# Altium schematic sheet K60单片机系统板原理图.SchDoc
size A4
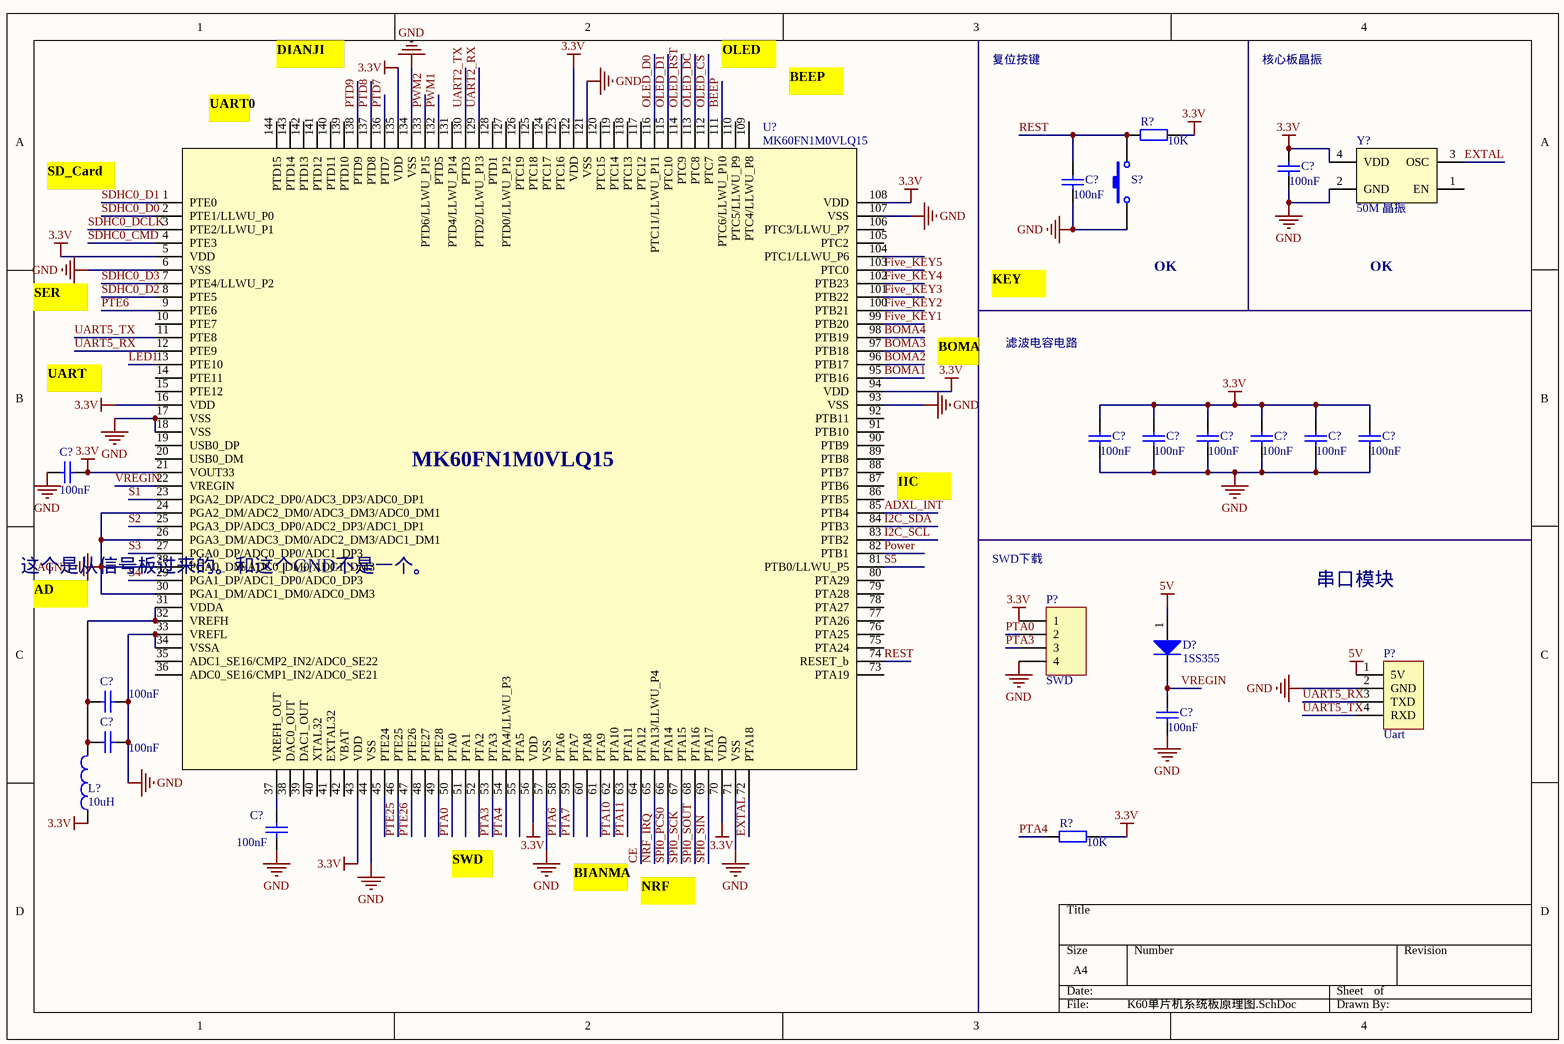
[diagram p0: K60单片机系统板原理图.SchDoc]

## Parts
(Parts that share a designator on the sheet are numbered #1, #2 ... from top to bottom, then left to right.)
C?#1  value 100nF  [C0603]  (hidden comment: Cap)
C?#2  value 100nF  [C0603]  (hidden comment: Cap)
C?#3  value 100nF  [C0603]  (hidden comment: Cap)
C?#4  value 100nF  [C0603]  (hidden comment: Cap)
C?#5  value 100nF  [C0603]  (hidden comment: Cap)
C?#6  value 100nF  [C0603]  (hidden comment: Cap)
C?#7  value 100nF  [C0603]  (hidden comment: Cap)
C?#8  value 100nF  [C0603]  (hidden comment: Cap)
C?#9  value 100nF  [C0603]  (hidden comment: Cap)
C?#10  value 100nF  [C0603]  (hidden comment: Cap)
C?#11  value 100nF  [C0603]  (hidden comment: Cap)
C?#12  value 100nF  [C0603]  (hidden comment: Cap)
C?#13  value 100nF  [C0603]  (hidden comment: Cap)
D?  1SS355  [二极管贴片]
L?  value 10uH  [R0603]  (hidden comment: Inductor)
P?#1  SWD  [HDR1X4]
P?#2  Uart  [HDR1X4]
R?#1  value 10K  [R0603]  (hidden comment: Res2)
R?#2  value 10K  [R0603]  (hidden comment: Res2)
S?  SW-PB  [KEY]  (value not drawn)
U?  MK60FN1M0VLQ15  [K60_QFP144]
Y?  50M 晶振  [50MHz_MiNi]

## Nets
3.3V: C?#1.1 C?#3.1 C?#4.1 C?#5.1 C?#6.1 C?#7.1 C?#8.1 C?#9.2 L?.1 P?#1.1 R?#1.2 R?#2.2 U?.5(VDD) U?.16(VDD) U?.21(VOUT33) U?.43(VDD) U?.56(VDD) U?.70(VDD) U?.94(VDD) U?.108(VDD) U?.122(VDD) U?.135(VDD) Y?.4(VDD)
5V: D?.1(A) P?#2.1(5V)
AGND: U?.24(PGA2_DM/ADC2_DM0/ADC3_DM3/ADC0_DM1) U?.26(PGA3_DM/ADC3_DM0/ADC2_DM3/ADC1_DM1) U?.28(PGA0_DM/ADC0_DM0/ADC1_DM3) U?.30(PGA1_DM/ADC1_DM0/ADC0_DM3)
GND: C?#1.2 C?#2.2 C?#3.2 C?#4.2 C?#5.2 C?#6.2 C?#7.2 C?#8.2 C?#9.1 C?#10.2 C?#11.1 C?#12.2 C?#13.2 P?#1.4 P?#2.2(GND) S?.1 U?.6(VSS) U?.17(VSS) U?.18(VSS) U?.33(VREFL) U?.34(VSSA) U?.44(VSS) U?.57(VSS) U?.71(VSS) U?.93(VSS) U?.107(VSS) U?.121(VSS) U?.134(VSS) Y?.2(GND)
ADXL_INT: U?.85(PTB4)
BEEP: U?.111(PTC6/LLWU_P10)
BOMA1: U?.95(PTB16)
BOMA2: U?.96(PTB17)
BOMA3: U?.97(PTB18)
BOMA4: U?.98(PTB19)
CE: U?.64(PTA12)
EXTAL: U?.72(PTA18) Y?.3(OSC)
Five_KEY1: U?.99(PTB20)
Five_KEY2: U?.100(PTB21)
Five_KEY3: U?.101(PTB22)
Five_KEY4: U?.102(PTB23)
Five_KEY5: U?.103(PTC0)
I2C_SCL: U?.83(PTB2)
I2C_SDA: U?.84(PTB3)
LED1: U?.13(PTE10)
NRF_IRQ: U?.65(PTA13/LLWU_P4)
OLED_CS: U?.112(PTC7)
OLED_D0: U?.116(PTC11/LLWU_P11)
OLED_D1: U?.115(PTC10)
OLED_DC: U?.113(PTC8)
OLED_RST: U?.114(PTC9)
Power: U?.82(PTB1)
PTA0: P?#1.2 U?.50(PTA0)
PTA3: P?#1.3 U?.53(PTA3)
PTA4: R?#2.1 U?.54(PTA4/LLWU_P3)
PTA6: U?.58(PTA6)
PTA7: U?.59(PTA7)
PTA10: U?.62(PTA10)
PTA11: U?.63(PTA11)
PTD7: U?.136(PTD7)
PTD8: U?.137(PTD8)
PTD9: U?.138(PTD9)
PTE6: U?.9(PTE6)
PTE25: U?.46(PTE25)
PTE26: U?.47(PTE26)
PWM1: U?.132(PTD5)
PWM2: U?.133(PTD6/LLWU_P15)
REST: C?#2.1 R?#1.1 S?.2 U?.74(RESET_b)
S1: U?.23(PGA2_DP/ADC2_DP0/ADC3_DP3/ADC0_DP1)
S2: U?.25(PGA3_DP/ADC3_DP0/ADC2_DP3/ADC1_DP1)
S3: U?.27(PGA0_DP/ADC0_DP0/ADC1_DP3)
S4: U?.29(PGA1_DP/ADC1_DP0/ADC0_DP3)
S5: U?.81(PTB0/LLWU_P5)
SDHC0_CMD: U?.4(PTE3)
SDHC0_D0: U?.2(PTE1/LLWU_P0)
SDHC0_D1: U?.1(PTE0)
SDHC0_D2: U?.8(PTE5)
SDHC0_D3: U?.7(PTE4/LLWU_P2)
SDHC0_DCLK: U?.3(PTE2/LLWU_P1)
SPI0_PCS0: U?.66(PTA14)
SPI0_SCK: U?.67(PTA15)
SPI0_SIN: U?.69(PTA17)
SPI0_SOUT: U?.68(PTA16)
UART2_RX: U?.129(PTD2/LLWU_P13)
UART2_TX: U?.130(PTD3)
UART5_RX: P?#2.3(TXD) U?.12(PTE9)
UART5_TX: P?#2.4(RXD) U?.11(PTE8)
VREGIN: C?#11.2 D?.2(K) U?.22(VREGIN)
NetC?#10_1: C?#10.1 C?#12.1 L?.2 U?.31(VDDA) U?.32(VREFH)
NetC?#13_1: C?#13.1 U?.37(VREFH_OUT)

Not connected (* = marked no-connect by the designer): U? 10(PTE7) 14(PTE11) 15(PTE12) 19(USB0_DP) 20(USB0_DM) 35(ADC1_SE16/CMP2_IN2/ADC0_SE22) 36(ADC0_SE16/CMP1_IN2/ADC0_SE21) 38(DAC0_OUT) 39(DAC1_OUT) 40(XTAL32) 41(EXTAL32) 42(VBAT) 45(PTE24) 48(PTE27) 49(PTE28) 51(PTA1) 52(PTA2) 55(PTA5) 60(PTA8) 61(PTA9) 73(PTA19) 75(PTA24) 76(PTA25) 77(PTA26) 78(PTA27) 79(PTA28) 80(PTA29) 86(PTB5) 87(PTB6) 88(PTB7) 89(PTB8) 90(PTB9) 91(PTB10) 92(PTB11) 104(PTC1/LLWU_P6) 105(PTC2) 106(PTC3/LLWU_P7) 109(PTC4/LLWU_P8) 110(PTC5/LLWU_P9) 117(PTC12) 118(PTC13) 119(PTC14) 120(PTC15) 123(PTC16) 124(PTC17) 125(PTC18) 126(PTC19) 127(PTD0/LLWU_P12) 128(PTD1) 131(PTD4/LLWU_P14) 139(PTD10) 140(PTD11) 141(PTD12) 142(PTD13) 143(PTD14) 144(PTD15); Y? 1(EN)

## Notes on the sheet
- (near U?) UART0
- DIANJI
- OLED
- BEEP
- 复位按键
- 核心板晶振
- SD_Card
- OK
- SER
- KEY
- UART
- BOMA
- 滤波电容电路
- (near U?) IIC
- (near U?) 这个是从信号板过来的。和这个GND不是一个。
- SWD下载
- 串口模块
- AD
- SWD
- BIANMA
- NRF

## Library data of the parts
C?#1-C?#13 = Cap: Capacitor; Published: 8-Jun-2000; LatestRevisionDate: 17-Jul-2002; LatestRevisionNote: Re-released for DXP Platform.; PackageReference: RAD-0.3; Publisher: Altium Limited
  C?#11: PackageDescription: Radial Cap, Thru-Hole; 2 Leads; 0.3 in Pin Spacing
D? = Diode 1N4002: 1 Amp General Purpose Rectifier; Published: 8-Jun-2000; LatestRevisionDate: 17-Jul-2002; LatestRevisionNote: Re-released for DXP Platform.; DatasheetVersion: 1998; PackageVersion: Aug-1999; PackageReference: DO-41; Publisher: Altium Limited; PackageDescription: Diode, Axial; Body 5.2 x 2.7 mm (LxDia. max), Lead Dia. 0.86 mm (max); Code_JEDEC: DO-204-AL; ComponentLink1Description: Manufacturer Link; ComponentLink1URL: http://www.fairchildsemi.com/; ComponentLink2Description: Datasheet; ComponentLink2URL: http://www.fairchildsemi.com/ds/1N%2F1N4001.pdf
L? = Inductor: Code_IEC: 1005; Published: 8-Jun-2000; LatestRevisionDate: 17-Jul-2002; LatestRevisionNote: Re-released for DXP Platform.; PackageReference: 0402-A; Publisher: Altium Limited; Code_JEITA: 0402
P?#1 P?#2 = Header 4: Header, 4-Pin; LatestRevisionDate: 17-Jul-2002; LatestRevisionNote: Re-released for DXP Platform.; Publisher: Altium Limited
R?#1 R?#2 = Res2: Resistor; Published: 8-Jun-2000; LatestRevisionDate: 17-Jul-2002; LatestRevisionNote: Re-released for DXP Platform.; PackageReference: AXIAL-0.4; Publisher: Altium Limited
S? = SW-PB: Switch; Published: 24-Mar-1999; LatestRevisionDate: 17-Jul-2002; LatestRevisionNote: Re-released for DXP Platform.; PackageReference: SPST-2; Publisher: Altium Limited